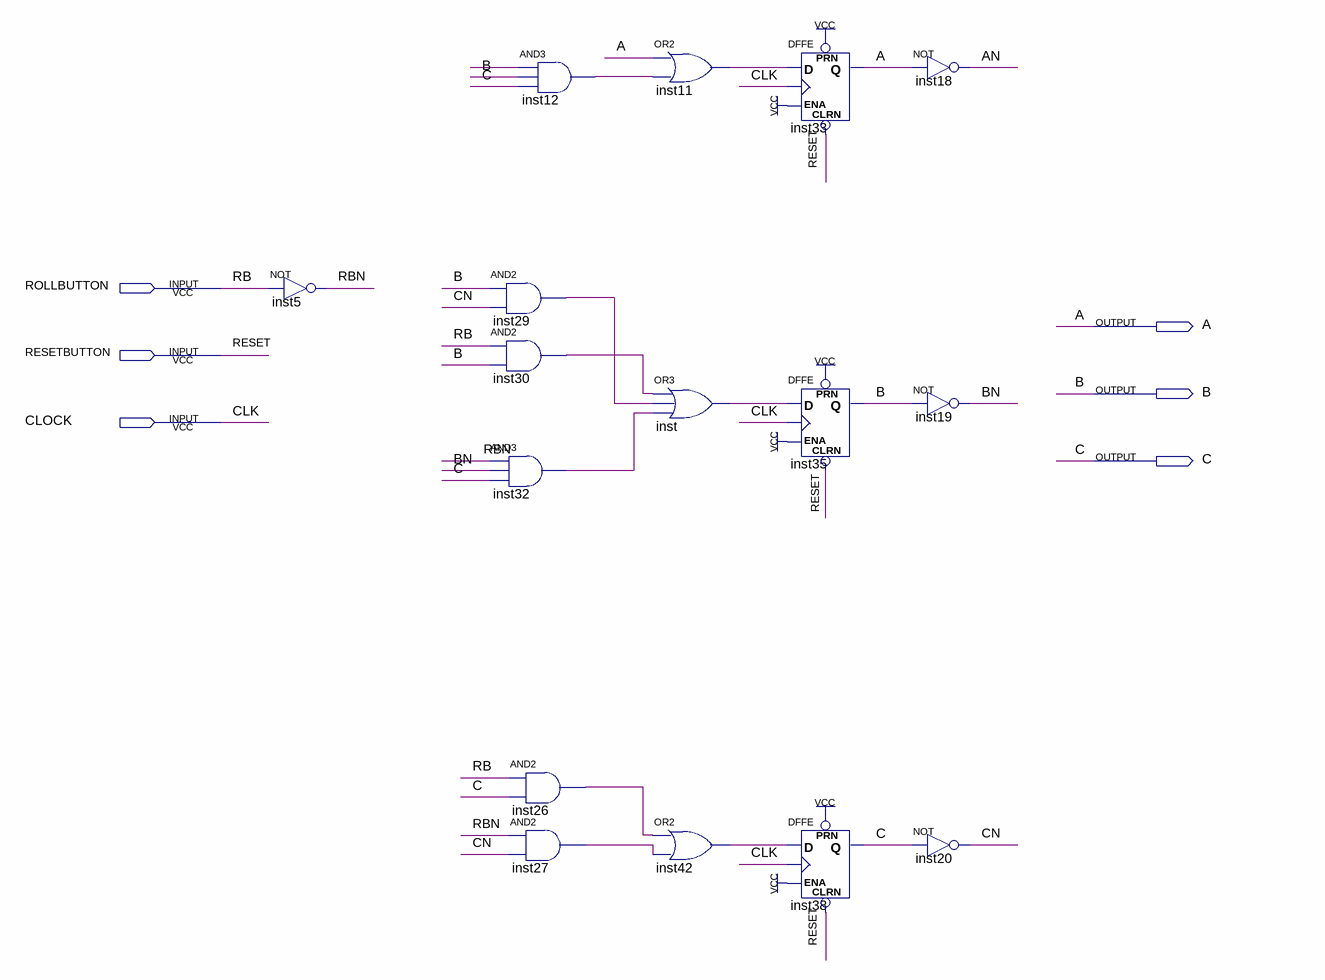
[diagram p0: schematic sheet]
// Quartus schematic TurnCounter.bdf as structural Verilog: 16 symbols, 6 pins
module TurnCounter (
  input  ROLLBUTTON,
  input  RESETBUTTON,
  input  CLOCK,
  output A,
  output B,
  output C
);

  wire AN, BN, CN, inst11_out, inst12_out, inst26_out, inst27_out, inst29_out, inst30_out, inst32_out,
       inst42_out, inst_out, RBN, undriven;

  not inst5 (RBN, ROLLBUTTON);
  and inst29 (inst29_out, B, CN);
  and inst30 (inst30_out, ROLLBUTTON, B);
  and inst32 (inst32_out, RBN, BN, C);
  and inst12 (inst12_out, undriven, B, C);
  and inst26 (inst26_out, ROLLBUTTON, C);
  and inst27 (inst27_out, RBN, CN);
  or inst11 (inst11_out, A, inst12_out);
  or inst (inst_out, inst30_out, inst29_out, inst32_out);
  or inst42 (inst42_out, inst26_out, inst27_out);
  DFFE inst33 (.PRN(1'b1), .CLRN(RESETBUTTON), .D(inst11_out), .CLK(CLOCK), .ENA(1'b1), .Q(A));
  DFFE inst35 (.PRN(1'b1), .CLRN(RESETBUTTON), .D(inst_out), .CLK(CLOCK), .ENA(1'b1), .Q(B));
  DFFE inst38 (.PRN(1'b1), .CLRN(RESETBUTTON), .D(inst42_out), .CLK(CLOCK), .ENA(1'b1), .Q(C));
  not inst18 (AN, A);
  not inst19 (BN, B);
  not inst20 (CN, C);

  // Other names for the same wires on the sheet: CLK = CLOCK; RB = ROLLBUTTON; RESET = RESETBUTTON
endmodule
